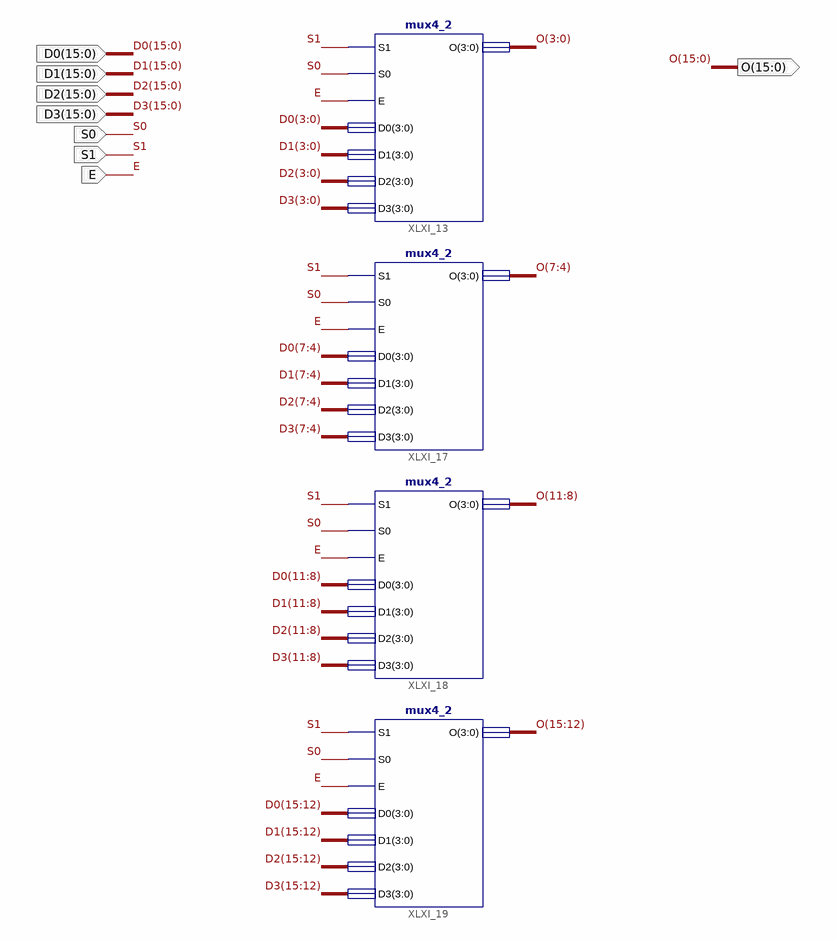
[diagram p0: schematic sheet 1]
// Xilinx ISE schematic mux16_2.sch (spartan3e) as structural Verilog: 4 symbols, 8 ports
module mux16_2 (
  input  S1,
  input  E,
  input  S0,
  input  [15:0] D0,
  input  [15:0] D1,
  input  [15:0] D2,
  input  [15:0] D3,
  output [15:0] O
);

  mux4_2 XLXI_13 (.S1(S1), .S0(S0), .E(E), .D0(D0[3:0]), .D1(D1[3:0]), .D2(D2[3:0]), .D3(D3[3:0]), .O(O[3:0]));
  mux4_2 XLXI_17 (.S1(S1), .S0(S0), .E(E), .D0(D0[7:4]), .D1(D1[7:4]), .D2(D2[7:4]), .D3(D3[7:4]), .O(O[7:4]));
  mux4_2 XLXI_18 (.S1(S1), .S0(S0), .E(E), .D0(D0[11:8]), .D1(D1[11:8]), .D2(D2[11:8]), .D3(D3[11:8]), .O(O[11:8]));
  mux4_2 XLXI_19 (
    .S1(S1), .S0(S0), .E(E), .D0(D0[15:12]), .D1(D1[15:12]), .D2(D2[15:12]), .D3(D3[15:12]), .O(O[15:12]));
endmodule
